# EAGLE design LCM (EAGLE 9.6.2)
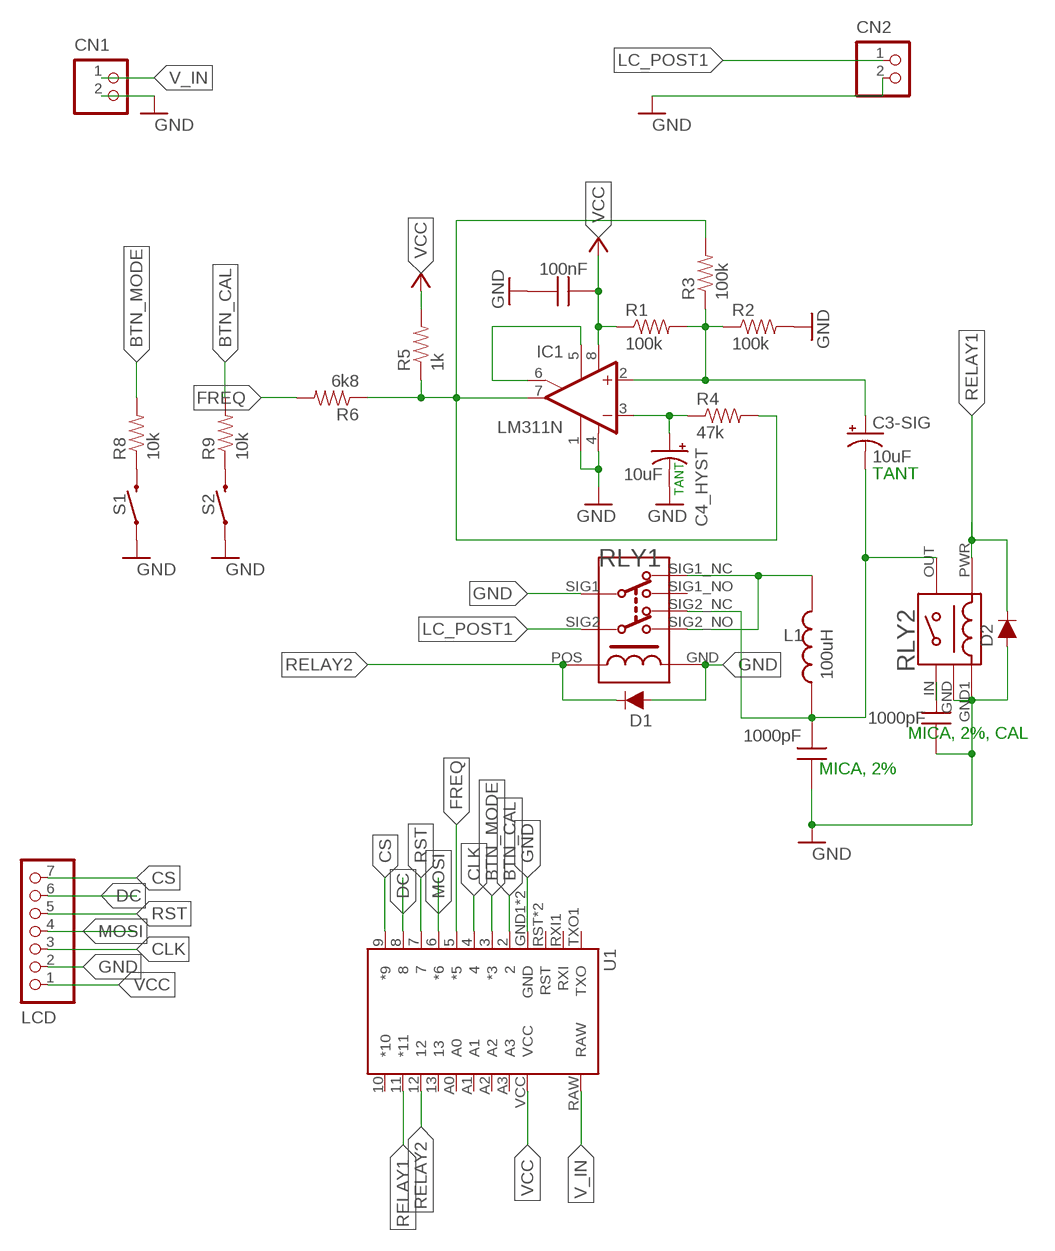
[diagram p0: schematic, sheet 1]

## Parts
C1  1000pF  CAPACITORPITCH3  [CAPACITOR_PITCH3]
C2  1000pF  CAPACITORPITCH3  [CAPACITOR_PITCH3]
C3-SIG  10uF  CAPACITOR_POLAR_5MM  [CAPACITOR_POLAR]
C4_HYST  10uF  CAPACITOR_POLAR_5MM  [CAPACITOR_POLAR]
C5  100nF  CAPACITORPITCH4  [CAPACITOR_PITCH4]
CN1  CONNECTOR-JST-2  [CONNECTOR-JST-2]
CN2  CONNECTOR-JST-2  [CONNECTOR-JST-2]
D1  DIODEPITCH_3  [DIODE_PITCH3]
D2  DIODEPITCH_3  [DIODE_PITCH3]
IC1  LM311N  [DIL08]
L1  100uH  INDUCTOR-12.5MMWUERTH_ELEKTRONIK_7447480681_0_0  [INDUCTOR-12.5MM]
LCD  CONNECTOR-JST-7  [CONNECTOR-JST-7]
R1  100k  RESISTORPITCH5  [RESISTOR_PITCH5]
R2  100k  RESISTORPITCH3  [RESISTOR_PITCH3]
R3  100k  RESISTORPITCH4  [RESISTOR_PITCH4]
R4  47k  RESISTORPITCH3  [RESISTOR_PITCH3]
R5  1k  RESISTORPITCH3  [RESISTOR_PITCH3]
R6  6k8  RESISTORPITCH4  [RESISTOR_PITCH4]
R8  10k  RESISTORPITCH3  [RESISTOR_PITCH3]
R9  10k  RESISTORPITCH3  [RESISTOR_PITCH3]
RLY1  RELAY_5W-KRELAY-5W-K  [RELAY_5W-K]
RLY2  REED_RELAY  [REED_RELAY]
S1  MOMENTARY-SWITCH-SPST  [TACTILE_SWITCH]
S2  MOMENTARY-SWITCH-SPST  [TACTILE_SWITCH]
U1  ARDUINO_PRO_MINI_NO_PRG_HEADER_NOA5NO_A5  [ARDUINO_PRO_MINI_IN_HEADER_NOA5]

## Nets
BTN_CAL: R9.2 U1.2
BTN_MODE: R8.2 U1.3(*3)
CLK: LCD.3 U1.4
CS: LCD.7 U1.9(*9)
DC: LCD.6 U1.8
FREQ: IC1.7(OUT) R3.2 R4.2 R5.1 R6.1 R6.2 U1.5(*5)
GND: C1.1(+) C2.1(+) C4_HYST.2(-) C5.1(+) CN1.2 CN2.2 D1.ANODE(A) D2.ANODE(A) IC1.1(GND) IC1.4(V-) LCD.2 R2.2 RLY1.GND RLY1.SIG1 RLY2.GND RLY2.GND1(PWR1) S1.1 S1.2 S2.1 S2.2 U1.GND1(GND) U1.GND4(GND)
LC_POST1: CN2.1 RLY1.SIG2
MOSI: LCD.4 U1.6(*6)
N$6: R8.1 S1.3 S1.4
N$7: R9.1 S2.3 S2.4
PIN2: C3-SIG.1(+) IC1.2(+IN) R1.2 R2.1 R3.1
PIN3: C4_HYST.1(+) IC1.3(-IN) R4.1
RELAY1: D2.CATHODE(C) RLY2.PWR(PWR2) U1.11(*11)
RELAY2: D1.CATHODE(C) RLY1.POS U1.12
RST: LCD.5 U1.7
SIG: C2.2(-) RLY2.IN(SIG1)
SIG2_NC: C1.2(-) C3-SIG.2(-) L1.2 RLY1.SIG2_NC(SIG1_NC) RLY2.OUT(SIG2)
SIG2_NO: L1.1 RLY1.SIG1_NC(SIG2_NC) RLY1.SIG2_NO(SIG1_NO)
STROBE: IC1.5(ON) IC1.6(ON/STR)
V_IN: CN1.1 U1.RAW
VCC: C5.2(-) IC1.8(V+) LCD.1 R1.1 R5.2 U1.VCC ; supply symbol labelled +5V
Unconnected: RLY1.SIG1_NO(SIG2_NO) U1.10(*10) U1.13 U1.A0 U1.A1 U1.A2 U1.A3 U1.RST U1.RST1(RST) U1.RXI1(RXI) U1.TXO1(TXO)

## Notes on the sheet
- TANT
- TANT
- MICA, 2%, CAL
- MICA, 2%

## Library data of the parts
C1 C2 C5 = my-lib:CAPACITOR: 1,000µF/1mF ceramic capacitors A capacitor is a passive two-terminal electrical component used to store electrical energy temporarily in an electric field. CAP-08070
C3-SIG C4_HYST = my-lib:CAPACITOR_POLAR: 1,000µF/1mF ceramic capacitors A capacitor is a passive two-terminal electrical component used to store electrical energy temporarily in an electric field. CAP-08070
CN1 CN2 = my-lib:CONNECTOR-JST-2: Wire-to-Board 2.5mm pitch top mount connector Source: http://www.jst-mfg.com/product/pdf/jpn/XH.pdf http://www.jst-mfg.com/product/detail.php?series=277
D1 D2 = my-lib:DIODE: Diode These are standard reverse protection diodes and small signal diodes. SparkFun Products: SparkFun SparkPunk Sound Kit <https://www.sparkfun.com/products/11177> SparkFun ESP8266 Thing <https://www.sparkfun.com/products/13231>
IC1 = linear:LM311: COMPARATOR
L1 = my-lib:INDUCTOR-12.5MM: PAS-IND-INDUCTOR-2; CIIVA_IDS: 3988453; COMPONENT_LINK_1_DESCRIPTION: Manufacturer URL; COMPONENT_LINK_1_URL: http://www.we-online.com; DATASHEET: http://www.we-online.de/katalog/media/pdf/7447480681.pdf; FOOTPRINT_VARIANT_NAME_0: Manufacturer Recommended; IMPORTED: yes; IMPORTED_FROM: vault; IMPORT_TS: 1521843801; INDUCTANCE: 680 ÂμH; MF: Wuerth Elektronik; MPN: 7447480681; PACKAGE: WE-TI 1014; PREFIX: L; RELEASE_DATE: 1421231046; VAULT_GUID: BDC5952A-9018-41A3-8876-95757894AD88; VAULT_REVISION: 52C45E80-BFFA-46E4-96F6-DAC9EAD59C8D
LCD = my-lib:CONNECTOR-JST-7: Wire-to-Board 2.5mm pitch top mount connector Source: http://www.jst-mfg.com/product/pdf/jpn/XH.pdf http://www.jst-mfg.com/product/detail.php?series=277
R1-R6 R8 R9 = my-lib:RESISTOR: .
RLY1 = my-lib:RELAY_5W-K: Electromechanical Relay 5VDC 178Ohm 2A DPDT (14.9x7.4x9.7)mm THT Signal Relay; AUTOMOTIVE: No; CENTROID_NOT_SPECIFIED: No; COIL_POWER: 140mW; COIL_RESISTANCE: 178Ω; COIL_TYPE: Non-Latching; COIL_VOLTAGE: 5V; DATASHEET: https://www.fujitsu.com/downloads/MICRO/fcai/relays/na.pdf; DEVICE_CLASS_L1: Electromechanical; DEVICE_CLASS_L2: Relays; DEVICE_CLASS_L3: Signal Relays; FOOTPRINT_VARIANT_NAME_0: Recommended_Land_Pattern; HEIGHT: 10mm; LEAD_FREE: Yes; MF: Fujitsu; MFG_PACKAGE_IDENT: NA-5W-K; MFG_PACKAGE_IDENT_DATE: 0; MFG_PACKAGE_IDENT_REV: 0; MOUSER_DESCRIPTION: Low Signal Relays - PCB Mini Signal 5VDC; MOUSER_PART_NUMBER: 817-NA-5W-K; MPN: NA-5W-K; NUMBER_OF_CONTACTS: 2; PACKAGE: PTH_RELAY_14MM9_7MM4; PREFIX: K; ROHS: Yes; SWITCHING_CURRENT: 2A; SWITCHING_POWER: 30W; TEMPERATURE_RANGE_HIGH: +85°C; TEMPERATURE_RANGE_LOW: -40°C; THROW_CONFIGURATION: DPDT; VERIFICATION_VERSION: 0.0.0.2; VOLTAGE_RATING_AC: 250V; VOLTAGE_RATING_DC: 220V
RLY2 = my-lib:REED_RELAY: REED RELAY, SPST-NO, 5VDC, 0.5A, THD
S1 S2 = my-lib:MOMENTARY-SWITCH-SPST: Momentary Switch (Pushbutton) - SPST
U1 = my-lib:ARDUINO_PRO_MINI_NO_PRG_HEADER_NOA5: SparkFun Pro Mini Pro Mini compatible footprint. Dimensions: 0.7 x 1.3" PCB Thickness: 0.8mm SparkFun Products: 3.3V/8MHz <https://www.sparkfun.com/products/11114> 5V/16MHz <https://www.sparkfun.com/products/11113>

## Board
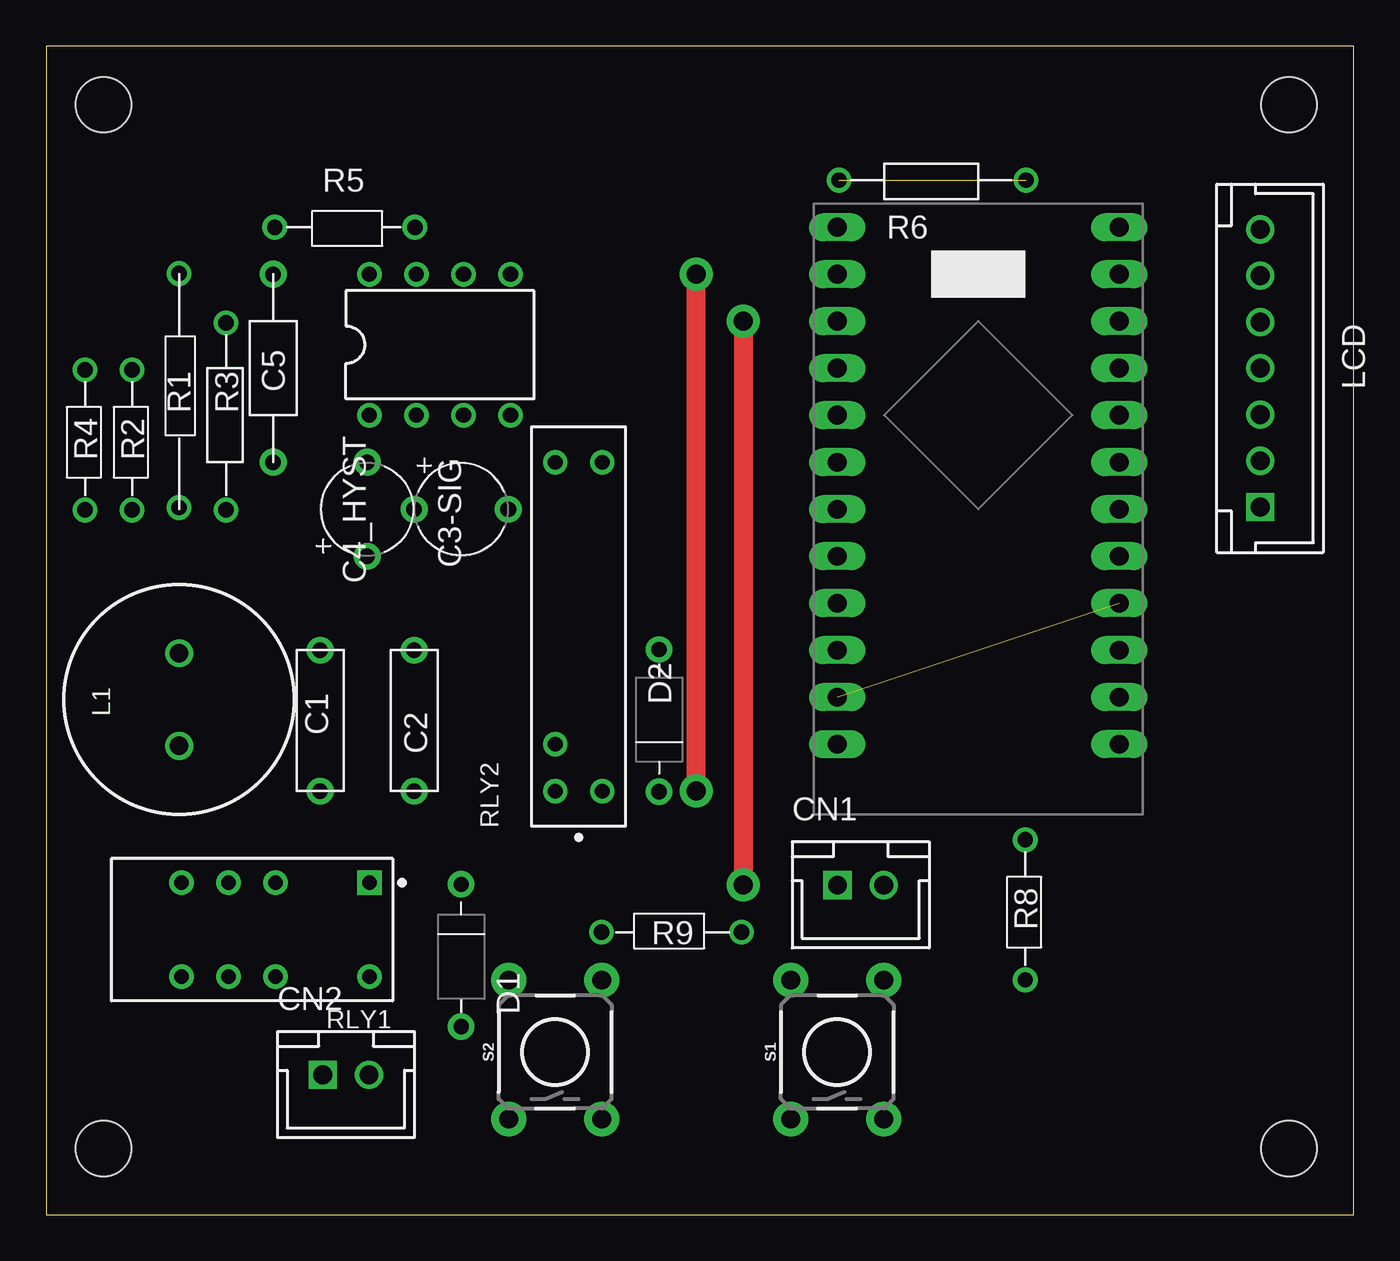
[diagram p1: board, top side]
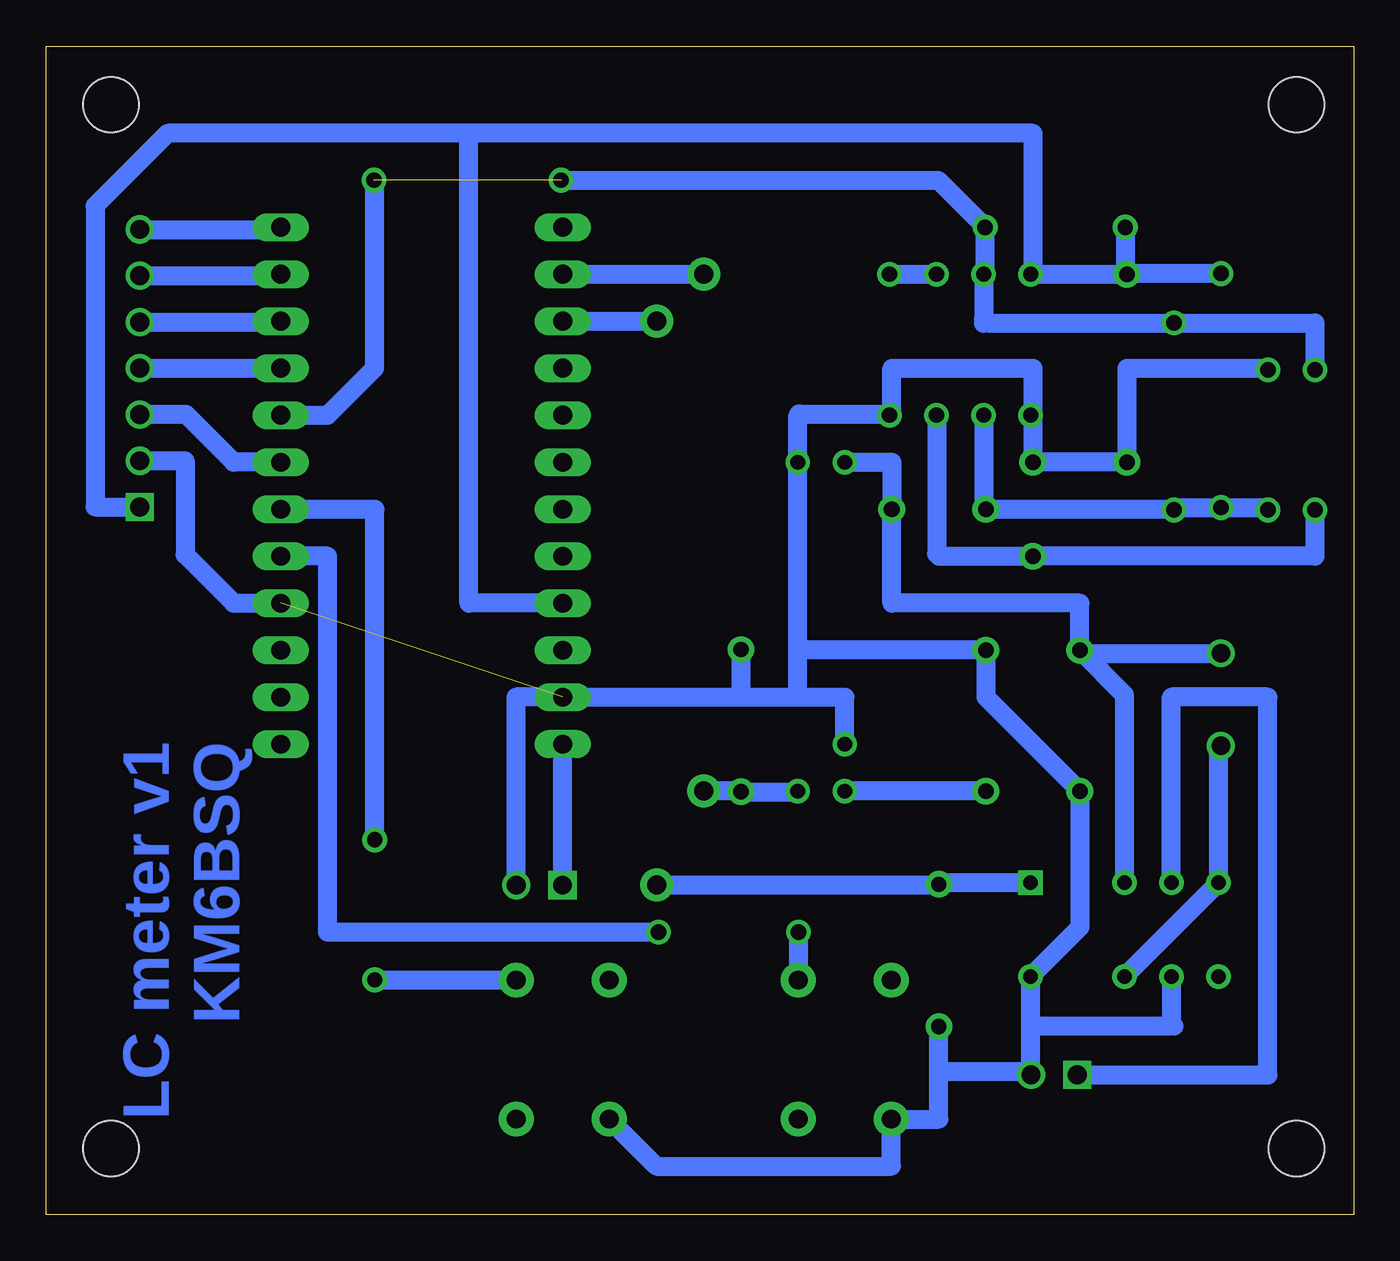
[diagram p2: board, bottom side, seen from below]

Size 70.64 x 63.16 mm. Coordinates in mm from the lower left corner, seen from the top.
Outline: 0,0 70.64,0 70.64,63.16 0,63.16 0,0
Copper layers (1*16): Top 0.035mm / dielectric 1.5mm / Bottom 0.035mm
Design rules "default *": minimum track width 6mil, minimum drill 0.35mm, track to track 6mil, track to pad 6mil, pad to pad 6mil, via to via 6mil, smd to smd 6mil, copper to edge 40mil, drill to drill 6mil, minimum pad ring 10mil, minimum via ring 8mil, stop-mask expansion 4mil, vias tented up to drill 0mil, thermal gap 40mil
Holes 3 mm at 3.1,3.58 3.1,60 67.14,60 67.14,3.58

### Footprints (pad centres in the part's own frame; a part is rotated, then mirrored left to right if it is on the bottom)
CAPACITOR_PITCH3 = drill 0.85 pad 1.45: 1 -2.54,0; 2 5.08,0
CAPACITOR_POLAR = drill 0.85 pad 1.45: 1 -2.54,0; 2 2.54,0
CAPACITOR_PITCH4 = drill 0.85 pad 1.45: 1 -5.08,0; 2 5.08,0
CONNECTOR-JST-2 = drill 1.016 square: 1 -1.25,0 | drill 1.016: 2 1.25,0
DIODE_PITCH3 = drill 0.83 pad 1.43: ANODE 2.578,0; CATHODE -5.118,0
DIL08 = drill 0.813 pad 1.27: 1 -3.81,-3.81; 2 -1.27,-3.81; 3 1.27,-3.81; 4 3.81,-3.81; 5 3.81,3.81; 6 1.27,3.81; 7 -1.27,3.81; 8 -3.81,3.81
INDUCTOR-12.5MM = drill 1 pad 1.5: 1 -2.5,0; 2 2.5,0
CONNECTOR-JST-7 = drill 1.016 square: 1 -7.5,0 | drill 1.016: 2 -5,0; 3 -2.5,0; 4 0,0; 5 2.5,0; 6 5,0; 7 7.5,0
RESISTOR_PITCH5 = drill 0.83: 1 -5.118,0; 2 7.531,0
RESISTOR_PITCH3 = drill 0.83: 1 -2.578,0; 2 4.991,0
RESISTOR_PITCH4 = drill 0.83: 1 -5.118,0; 2 4.991,0
RELAY_5W-K = drill 0.8 pad 1.3: GND -6.35,2.54; SIG1 1.27,2.54; SIG1_NC -1.27,2.54; SIG1_NO 3.81,2.54; SIG2 1.27,-2.54; SIG2_NC -1.27,-2.54; SIG2_NO 3.81,-2.54 | drill 0.8 pad 1.3 square: POS -6.35,-2.54
REED_RELAY = drill 0.8 pad 1.3: GND 10.16,-2.54; GND1 -5.08,0; IN -7.62,0; OUT 10.16,0; PWR -7.62,-2.54
TACTILE_SWITCH = drill 1.016 pad 1.88: 1 -5.029,2.515; 2 2.489,2.515; 3 -5.029,-2.515; 4 2.489,-2.515
ARDUINO_PRO_MINI_IN_HEADER_NOA5 = drill 1.016 long: 2 -7.62,2.54; 3 -7.62,0; 4 -7.62,-2.54; 5 -7.62,-5.08; 6 -7.62,-7.62; 7 -7.62,-10.16; 8 -7.62,-12.7; 9 -7.62,-15.24; 10 7.62,-15.24; 11 7.62,-12.7; 12 7.62,-10.16; 13 7.62,-7.62; A0 7.62,-5.08; A1 7.62,-2.54; A2 7.62,0; A3 7.62,2.54; GND1 7.62,10.16; GND4 -7.62,5.08; RAW 7.62,12.7; RST 7.62,7.62; RST1 -7.62,7.62; RXI1 -7.62,10.16; TXO1 -7.62,12.7; VCC 7.62,5.08

### Placement (x,y rotation side)
C1  14.8,25.43 90 top
C2  19.88,27.97 270 top
C3-SIG  22.42,38.13 0 top
C4_HYST  17.34,38.13 90 top
C5  12.26,45.76 90 top
CN1  44.01,17.81 0 top
CN2  16.19,7.56 0 top
D1  22.42,12.74 270 top
D2  33.12,27.97 90 top
IC1  21.27,47.02 0 top
L1  7.18,27.85 90 top
LCD  65.6,45.76 90 top
R1  7.18,45.76 270 top
R2  4.64,40.67 90 top
R3  9.72,43.21 90 top
R4  2.1,40.67 90 top
R5  17.34,53.38 180 top
R6  47.82,55.92 180 top
R8  52.9,15.27 90 top
R9  32.58,15.27 0 top
RLY1  11.12,15.41 180 top
RLY2  27.5,30.52 90 top
S1  42.74,10.19 90 top
S2  27.5,10.19 90 top
U1  50.36,38.13 180 top

### Tracks (layer width: path | path; a pad name or v marks a point on that pad's centre or on a via)
BTN_CAL
  Bottom 1.016: R9.2 55.44,15.27 55.44,35.59 U1.2
BTN_MODE
  Bottom 1.016: U1.3 52.9,38.13 R8.2
CLK
  Bottom 0.508: LCD.3 65.56,43.22
  Bottom 1.016: U1.4 60.52,40.68 63.09,43.26 LCD.3
CS
  Bottom 1.016: LCD.7 58.1,53.26 U1.9
DC
  Bottom 1.016: LCD.6 58.06,50.76 U1.8
FREQ  (1 unrouted)
  Bottom 1.016: 20,48.42 IC1.7 19.91,50.92 R5.1 22.46,55.92 R6.2 | 20,48.42 20,48.17 | 20,48.42 19.79,48.21 R3.2 2.1,48.21 R4.2 | U1.5 55.45,43.21 52.9,45.76 52.9,55.88 R6.1
GND  (1 unrouted)
  Bottom 1.016: IC1.4 25.02,43.28 | 25.02,43.28 24.96,43.34 24.96,45.76 17.34,45.76 17.34,43.34 IC1.1 17.34,43.09 C4_HYST.2 C5.1 12.26,45.76 4.72,45.76 R2.2 | 25.02,43.28 29.97,43.28 30.04,43.21 RLY2.GND 30.04,30.52 | 30.04,27.97 30.04,30.52 | RLY2.GND1 27.5,27.97 30.04,27.97 | RLY1.GND 14.8,15.54 C1.1 19.88,27.97 C2.1 30.04,30.52 | 33.12,27.97 U1.GND1 45.28,27.97 45.28,17.84 CN1.2 | 33.12,27.97 30.04,27.97 | D2.ANODE 33.12,27.97 | LCD.2 63.14,40.76 63.14,35.67 60.52,33.05 U1.GND4 | S1.1 37.68,2.63 24.98,2.63 S2.1 22.42,5.17 22.42,7.73 | RLY1.SIG1 9.85,10.33 | 9.85,10.33 9.72,10.2 | 22.42,7.73 D1.ANODE | 22.42,7.73 17.61,7.73 CN2.2 17.47,7.58 RLY1.GND | RLY1.GND 17.47,10.33 17.34,10.2 9.97,10.2 9.85,10.33
  cutout Bottom (isolate 1.5): 0.56,62.04 0.56,1.04 70.56,1.04 70.56,62.04
LC_POST1
  Bottom 1.016: RLY1.SIG2 9.85,27.97 4.64,27.97 4.64,7.56 CN2.1
MOSI
  Bottom 1.016: LCD.4 U1.6
N$6
  Bottom 1.016: R8.1 52.88,12.68 S1.4
N$7
  Bottom 1.016: R9.1 30.01,15.2 S2.4
PIN2
  Bottom 1.016: IC1.2 20,38.26 C3-SIG.1 9.72,38.13 R3.1 9.59,38.22 R1.2 4.76,38.22 R2.1
PIN3
  Bottom 1.016: C4_HYST.1 17.3,35.56 | IC1.3 22.54,35.72 22.42,35.59 C4_HYST.1 | R4.1 2.1,35.59 C4_HYST.1
RELAY1  (via drill 1.02 pad 1.78)
  Top 1.016: v35.12,22.9 v35.12,50.84
  Bottom 1.016: RLY2.PWR 30.07,22.86 D2.CATHODE 33.16,22.9 v35.12,22.9 | U1.11 v35.12,50.84
RELAY2  (via drill 1.02 pad 1.78)
  Top 1.016: v37.66,48.3 v37.66,17.82
  Bottom 1.016: v37.66,48.3 U1.12 | v37.66,17.82 22.46,17.82 D1.CATHODE 22.33,17.95 RLY1.POS
RST
  Bottom 1.016: LCD.5 58.02,48.26 U1.7
SIG
  Bottom 1.016: C2.2 RLY2.IN
SIG2_NC
  Bottom 1.016: RLY2.OUT 24.96,40.67 C3-SIG.2 24.96,33.05 14.8,33.05 C1.2 | C1.2 14.63,30.35 L1.2 | C1.2 12.39,28.11 RLY1.SIG2_NC
SIG2_NO
  Bottom 1.016: L1.1 7.31,25.22 RLY1.SIG2_NO RLY1.SIG1_NC
STROBE
  Bottom 1.016: IC1.5 IC1.6
V_IN
  Bottom 1.016: U1.RAW 42.76,25.41 CN1.1
VCC
  Bottom 1.016: R5.2 12.35,50.92 12.29,50.87 | 12.29,50.87 C5.2 IC1.8 17.34,50.96 17.34,58.45 47.82,58.45 | R1.1 12.29,50.87 | U1.VCC 47.82,33.05 47.82,58.45 | 47.82,58.45 64.09,58.45 68,54.53 68,38.26 LCD.1

### Text on the board
Bottom: LC meter v1 / KM6BSQ